# Altium schematic sheet CONTROL.SchDoc: CONTROLS
size 292 x 254 mm; DocumentNumber: 15; Revision: 2.0; SheetNumber: 15; SheetTotal: 18
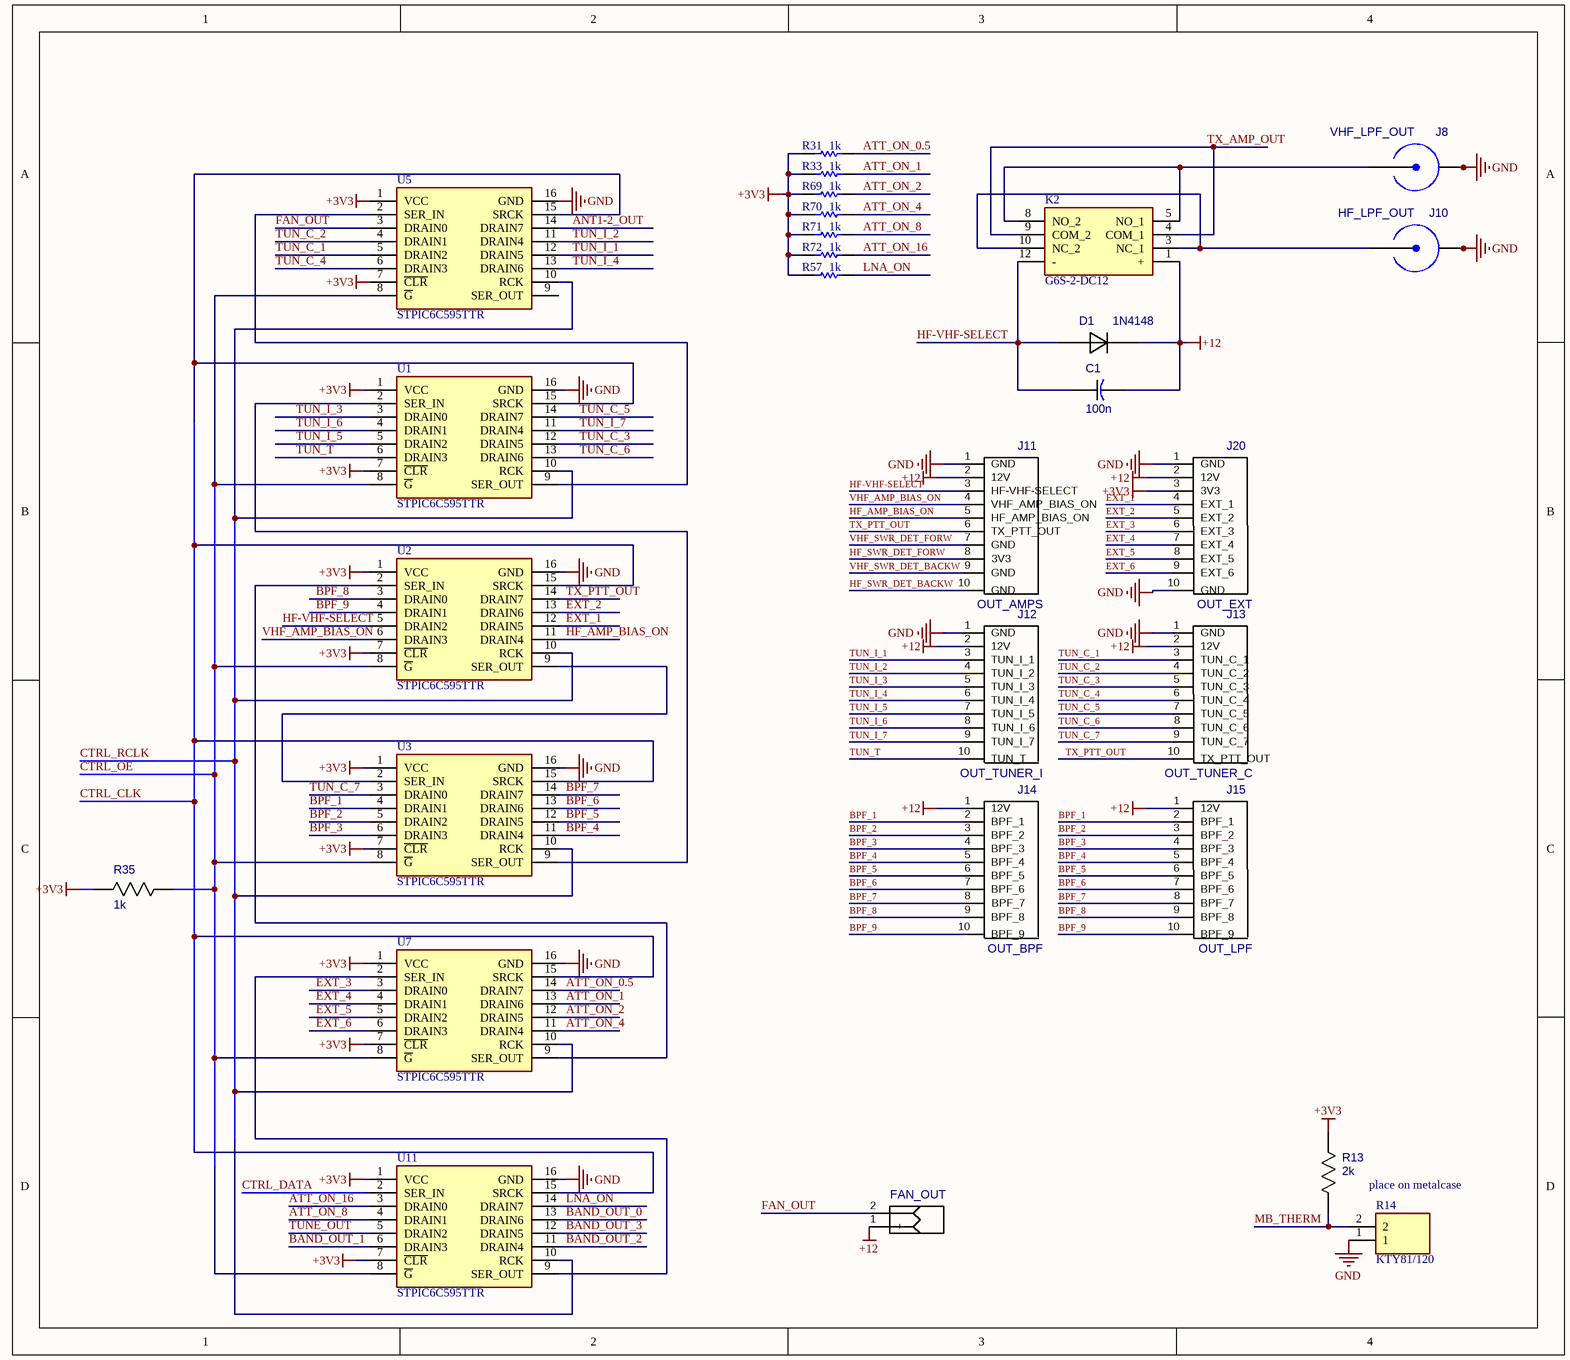
[diagram p0: CONTROL.SchDoc]

## Parts
C1  100n  [CAP_0805]
D1  1N4148  [SS14]
FAN_OUT  51022-0200  [51022-0200]  (value not drawn)
J8  VHF_LPF_OUT  [31-5431]
J10  HF_LPF_OUT  [31-5431]
J11  OUT_AMPS  [90131-0126]
J12  OUT_TUNER_I  [90131-0126]
J13  OUT_TUNER_C  [90131-0126]
J14  OUT_BPF  [90131-0126]
J15  OUT_LPF  [90131-0126]
J20  OUT_EXT  [90131-0126]
K2  G6S-2-DC12  [G6S2DC12]
R13  2k  [RES_0805]
R14  KTY81/120  [TO254P420X460X770-2P]
R31  1k  [RESC2013X60X40NL20T25]
R33  1k  [RESC2013X60X40NL20T25]
R35  1k  [RES_0805]
R57  1k  [RESC2013X60X40NL20T25]
R69  1k  [RESC2013X60X40NL20T25]
R70  1k  [RESC2013X60X40NL20T25]
R71  1k  [RESC2013X60X40NL20T25]
R72  1k  [RESC2013X60X40NL20T25]
U1  STPIC6C595TTR  [SOP65P640X120-16N]
U2  STPIC6C595TTR  [SOP65P640X120-16N]
U3  STPIC6C595TTR  [SOP65P640X120-16N]
U5  STPIC6C595TTR  [SOP65P640X120-16N]
U7  STPIC6C595TTR  [SOP65P640X120-16N]
U11  STPIC6C595TTR  [SOP65P640X120-16N]

## Nets
+3V3: J20.3(3V3) R13.2 R31.2 R33.2 R35.1 R57.2 R69.2 R70.2 R71.2 R72.2 U1.1(VCC) U1.7(~{CLR}) U2.1(VCC) U2.7(~{CLR}) U3.1(VCC) U3.7(~{CLR}) U5.1(VCC) U5.7(~{CLR}) U7.1(VCC) U7.7(~{CLR}) U11.1(VCC) U11.7(~{CLR})
+12: C1.2 D1.1(K) FAN_OUT.1(+) J11.2(12V) J12.2(12V) J13.2(12V) J14.1(12V) J15.1(12V) J20.2(12V) K2.1(+)
GND: J8.1(GND) J8.2(GND) J8.3(GND) J8.4(GND) J10.1(GND) J10.2(GND) J10.3(GND) J10.4(GND) J11.1(GND) J12.1(GND) J13.1(GND) J20.1(GND) J20.10(GND) R14.1 U1.16(GND) U2.16(GND) U3.16(GND) U5.16(GND) U7.16(GND) U11.16(GND)
ANT1-2_OUT: U5.14(DRAIN7)
ATT_ON_0.5: R31.1 U7.14(DRAIN7)
ATT_ON_1: R33.1 U7.13(DRAIN6)
ATT_ON_2: R69.1 U7.12(DRAIN5)
ATT_ON_4: R70.1 U7.11(DRAIN4)
ATT_ON_8: R71.1 U11.4(DRAIN1)
ATT_ON_16: R72.1 U11.3(DRAIN0)
BAND_OUT_0: U11.13(DRAIN6)
BAND_OUT_1: U11.6(DRAIN3)
BAND_OUT_2: U11.11(DRAIN4)
BAND_OUT_3: U11.12(DRAIN5)
BPF_1: J14.2(BPF_1) J15.2(BPF_1) U3.4(DRAIN1)
BPF_2: J14.3(BPF_2) J15.3(BPF_2) U3.5(DRAIN2)
BPF_3: J14.4(BPF_3) J15.4(BPF_3) U3.6(DRAIN3)
BPF_4: J14.5(BPF_4) J15.5(BPF_4) U3.11(DRAIN4)
BPF_5: J14.6(BPF_5) J15.6(BPF_5) U3.12(DRAIN5)
BPF_6: J14.7(BPF_6) J15.7(BPF_6) U3.13(DRAIN6)
BPF_7: J14.8(BPF_7) J15.8(BPF_7) U3.14(DRAIN7)
BPF_8: J14.9(BPF_8) J15.9(BPF_8) U2.3(DRAIN0)
BPF_9: J14.10(BPF_9) J15.10(BPF_9) U2.4(DRAIN1)
CTRL_CLK: U1.15(SRCK) U2.15(SRCK) U3.15(SRCK) U5.15(SRCK) U7.15(SRCK) U11.15(SRCK)
CTRL_DATA: U11.2(SER_IN)
CTRL_OE: R35.2 U1.8(~{G}) U2.8(~{G}) U3.8(~{G}) U5.8(~{G}) U7.8(~{G}) U11.8(~{G})
CTRL_RCLK: U1.10(RCK) U2.10(RCK) U3.10(RCK) U5.10(RCK) U7.10(RCK) U11.10(RCK)
EXT_1: J20.4(EXT_1) U2.12(DRAIN5)
EXT_2: J20.5(EXT_2) U2.13(DRAIN6)
EXT_3: J20.6(EXT_3) U7.3(DRAIN0)
EXT_4: J20.7(EXT_4) U7.4(DRAIN1)
EXT_5: J20.8(EXT_5) U7.5(DRAIN2)
EXT_6: J20.9(EXT_6) U7.6(DRAIN3)
FAN_OUT: FAN_OUT.2(-) U5.3(DRAIN0)
HF-VHF-SELECT: C1.1 D1.2(A) J11.3(HF-VHF-SELECT) K2.12(-) U2.5(DRAIN2)
HF_AMP_BIAS_ON: J11.5(HF_AMP_BIAS_ON) U2.11(DRAIN4)
HF_SWR_DET_BACKW: J11.10(GND)
HF_SWR_DET_FORW: J11.8(3V3)
LNA_ON: R57.1 U11.14(DRAIN7)
MB_THERM: R13.1 R14.2
TUN_I_1: J12.3(TUN_I_1) U5.12(DRAIN5)
TUN_I_2: J12.4(TUN_I_2) U5.11(DRAIN4)
TUN_I_3: J12.5(TUN_I_3) U1.3(DRAIN0)
TUN_I_4: J12.6(TUN_I_4) U5.13(DRAIN6)
TUN_I_5: J12.7(TUN_I_5) U1.5(DRAIN2)
TUN_I_6: J12.8(TUN_I_6) U1.4(DRAIN1)
TUN_I_7: J12.9(TUN_I_7) U1.11(DRAIN4)
TUN_T: J12.10(TUN_T) U1.6(DRAIN3)
TUN_С_1: J13.3(TUN_C_1) U5.5(DRAIN2)
TUN_С_2: J13.4(TUN_C_2) U5.4(DRAIN1)
TUN_С_3: J13.5(TUN_C_3) U1.12(DRAIN5)
TUN_С_4: J13.6(TUN_C_4) U5.6(DRAIN3)
TUN_С_5: J13.7(TUN_C_5) U1.14(DRAIN7)
TUN_С_6: J13.8(TUN_C_6) U1.13(DRAIN6)
TUN_С_7: J13.9(TUN_C_7) U3.3(DRAIN0)
TUNE_OUT: U11.5(DRAIN2)
TX_AMP_OUT: K2.4(COM_1) K2.9(COM_2)
TX_PTT_OUT: J11.6(TX_PTT_OUT) J13.10(TX_PTT_OUT) U2.14(DRAIN7)
VHF_AMP_BIAS_ON: J11.4(VHF_AMP_BIAS_ON) U2.6(DRAIN3)
VHF_SWR_DET_BACKW: J11.9(GND)
VHF_SWR_DET_FORW: J11.7(GND)
NetJ8_5: J8.5(CON) K2.5(NO_1) K2.8(NO_2)
NetJ10_5: J10.5(CON) K2.3(NC_1) K2.10(NC_2)
NetU1_2: U1.2(SER_IN) U3.9(SER_OUT)
NetU1_9: U1.9(SER_OUT) U5.2(SER_IN)
NetU2_2: U2.2(SER_IN) U7.9(SER_OUT)
NetU2_9: U2.9(SER_OUT) U3.2(SER_IN)
NetU7_2: U7.2(SER_IN) U11.9(SER_OUT)

Not connected (* = marked no-connect by the designer): U5 9(SER_OUT)

## Notes on the sheet
- place on metalcase
- Title
- Size:
- Date:
- A4
- Number:
- Time:
- Revision:
- Sheet
- of
- File:

## Library data of the parts
C1 = CAP_0805
J8 J10 = 31-5431: SMA
J11-J15 J20 = 90131-0126_1_1: 2*5 PIN; Value: *
K2 = G6S-2-DC12: Relay or Contactor; Manufacturer_Name: Omron Electronics; Datasheet Link: https://componentsearchengine.com/Datasheets/1/G6S-2-DC12.pdf; Height: 9.4mm; Manufacturer_Part_Number: G6S-2-DC12; Mouser Part Number: 653-G6S-2-DC12A; Mouser Price/Stock: https://www.mouser.co.uk/ProductDetail/Omron-Electronics/G6S-2-DC12/?qs=QGk6feVlqMLN9Ouv0QsFzA%3D%3D
R13 R35 = RES_0805
  R35: Value: 1k
R14 = KTY81_110: Integrated Circuit; Manufacturer_Name: Nexperia; Manufacturer_Part_Number: KTY81/110; Datasheet Link: https://www.nxp.com/docs/en/data-sheet/KTY81_SER.pdf; Height: 4.2mm
R31 R33 R57 R69-R72 = CMP-2001-00626-1: RES_0805; Manufacturer: Panasonic; Part Number: ERA-6AEB303V
U1-U3 U5 U7 U11 = STPIC6C595TTR: Integrated Circuit; Manufacturer_Name: STMicroelectronics; Datasheet Link: http://www.st.com/st-web-ui/static/active/en/resource/technical/document/datasheet/CD00020664.pdf; Height: 1.2mm; Manufacturer_Part_Number: STPIC6C595TTR; Mouser Part Number: 511-STPIC6C595T; Mouser Price/Stock: https://www.mouser.co.uk/ProductDetail/STMicroelectronics/STPIC6C595TTR?qs=Pgvhs884FskRYYZkj3y%2FSg%3D%3D; Arrow Part Number: STPIC6C595TTR; Arrow Price/Stock: https://www.arrow.com/en/products/stpic6c595ttr/stmicroelectronics
D1 = 1N4148: Value: *